# EAGLE design Gateway-Header (EAGLE 7.5.0)
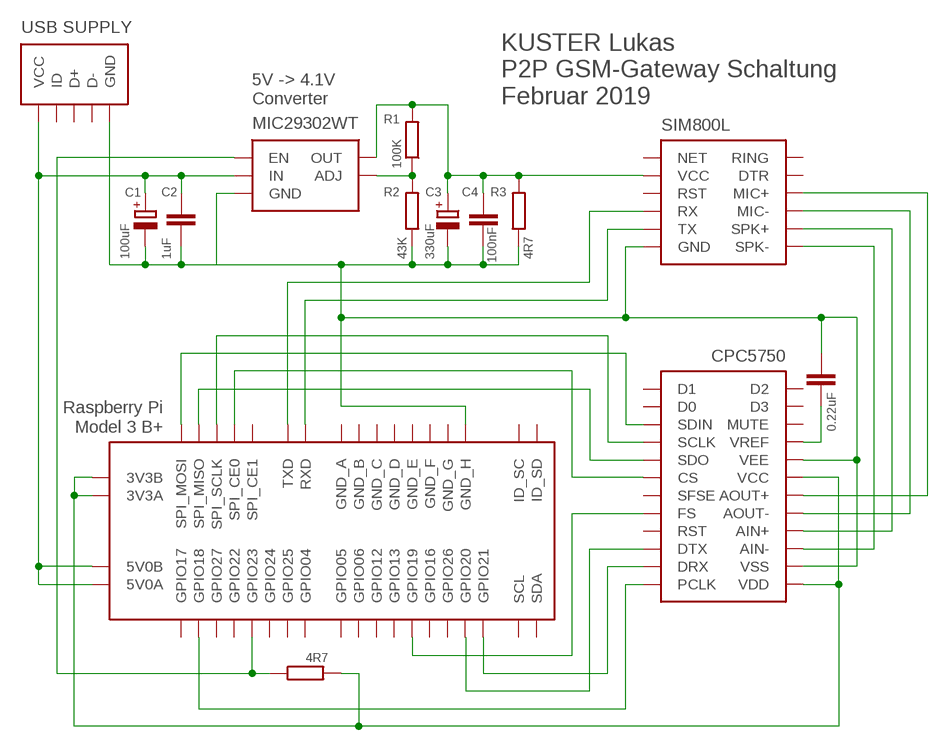
[diagram p0: schematic, sheet 1]

## Parts
C  0.22uF  C-EU025-025X050  [C025-025X050]
C1  100uF  CPOL-EUB45181B  [B45181B]
C2  1uF  C-EU025-025X050  [C025-025X050]
C3  330uF  CPOL-EUB45181B  [B45181B]
C4  100nF  C-EU025-025X050  [C025-025X050]
IC2  MIC29302WT  [TO254P483X1022X1511-5P]
R1  100K  R-EU_0204/7  [0204/7]
R2  43K  R-EU_0204/7  [0204/7]
R3  4R7  R-EU_0204/7  [0204/7]
R5  4R7  R-EU_0204/7  [0204/7]
U$4  CPC5750  [CPC5750]
U$5  SIM800LMODULE  [SIM800LMODULE]
U$6  ZX62D-B-5P8-JUNK  [ZX62D-B-5P8]
X1  RASPI_BOARD_B+#_H  [RASPI_BOARD_B+HAT]

## Nets
+3.3V: R5.2 U$4.V_CC(VCC) U$4.V_DD(VDD) X1.1(3V3A) X1.17(3V3B)
+4V: C3.+ C4.2 IC2.4(OUT) R1.2 R3.2 U$5.VCC
+5V: C1.+ C2.2 IC2.2(IN) U$6.P$1(VCC) X1.2(5V0A) X1.4(5V0B)
GND: C1.- C2.1 C3.- C4.1 C.2 IC2.3(GND) R2.1 R3.1 U$4.V_EE(VEE) U$4.V_SS(VSS) U$5.GND U$6.P$5(GND) X1.39(GND_H)
N$15: U$5.RX X1.8(TXD)
N$18: U$5.TX X1.10(RXD)
N$19: IC2.5(ADJ) R1.1 R2.2
N$20: U$4.A_IN-(AIN-) U$5.SPK-
N$21: U$4.A_IN+(AIN+) U$5.SPK+
N$22: U$4.A_OUT-(AOUT-) U$5.MIC-
N$23: U$4.A_OUT+(AOUT+) U$5.MIC+
N$24: C.1 U$4.V_REF(VREF)
N$25: U$4.CS X1.24(SPI_CE0)
N$26: U$4.SCLK X1.23(SPI_SCLK)
N$27: U$4.SDIN X1.19(SPI_MOSI)
N$28: U$4.SDO X1.21(SPI_MISO)
N$29: U$4.PCLK X1.12(GPIO18)
N$30: U$4.D_RX(DRX) X1.40(GPIO21)
N$31: U$4.D_TX(DTX) X1.38(GPIO20)
N$32: U$4.FS X1.35(GPIO19)
N$33: IC2.1(EN) R5.1 X1.16(GPIO23)
Unconnected: U$4.D0 U$4.D1 U$4.D2 U$4.D3 U$4.MUTE U$4.RST U$4.SFSEL(SFSE) U$5.DTR U$5.NET U$5.RING U$5.RST U$6.P$2(D-) U$6.P$3(D+) U$6.P$4(ID) X1.3(SDA) X1.5(SCL) X1.7(GPIO04) X1.11(GPIO17) X1.13(GPIO27) X1.15(GPIO22) X1.18(GPIO24) X1.22(GPIO25) X1.26(SPI_CE1) X1.27(ID_SD) X1.28(ID_SC) X1.29(GPIO05) X1.31(GPIO06) X1.32(GPIO12) X1.33(GPIO13) X1.36(GPIO16) X1.37(GPIO26)

## Notes on the sheet
- 5V -> 4.1V
  Converter
- KUSTER Lukas
  P2P GSM-Gateway Schaltung
  Februar 2019

## Power pins joined to a net without a drawn wire
GND_A: X1.6(GND_A)
GND_B: X1.9(GND_B)
GND_C: X1.14(GND_C)
GND_D: X1.20(GND_D)
GND_E: X1.25(GND_E)
GND_F: X1.30(GND_F)
GND_G: X1.34(GND_G)

## Library data of the parts
C C2 C4 = rcl:C-EU: CAPACITOR, European symbol
C1 C3 = rcl:CPOL-EU: POLARIZED CAPACITOR, European symbol
IC2 = MIC29302WT:MIC29302WT: MIC29302WT, Low Dropout Voltage Regulator, Adjustable 3A, 1.25 26 V +/-1%, 5-Pin TO-220 Source: Datasheet <http://ww1.microchip.com/downloads/en/devicedoc/20005685a.pdf>; DESCRIPTION: MIC29302WT, Low Dropout Voltage Regulator, Adjustable 3A, 1.25 26 V +/-1%, 5-Pin TO-220; HEIGHT: 4.826mm; MANUFACTURER_NAME: Micrel; MANUFACTURER_PART_NUMBER: MIC29302WT; MOUSER_PART_NUMBER: 998-MIC29302WT; MOUSER_PRICE-STOCK: https://www.mouser.com/Search/Refine.aspx?Keyword=998-MIC29302WT; RS_PART_NUMBER: 0254579P; RS_PRICE-STOCK: http://uk.rs-online.com/web/p/products/0254579P
R1-R3 R5 = rcl:R-EU_: RESISTOR, European symbol
U$4 = DA-CPC5750U-1:CPC5750
U$5 = SIM800LMODULE:SIM800LMODULE: SIM800L Module
U$6 = j_usb_hirose_zx62d-b-5p8:ZX62D-B-5P8-JUNK: Hirose MicroUSB A/B Connector
X1 = raspberrypi_bastelstube_v13:RASPI_BOARD_B+#: Raspberry Pi GPIO connector with markings for the outer dimensions of the Raspberry Pi board model B+ with different sets of drill holes or mounting pads All pins connected

## Board
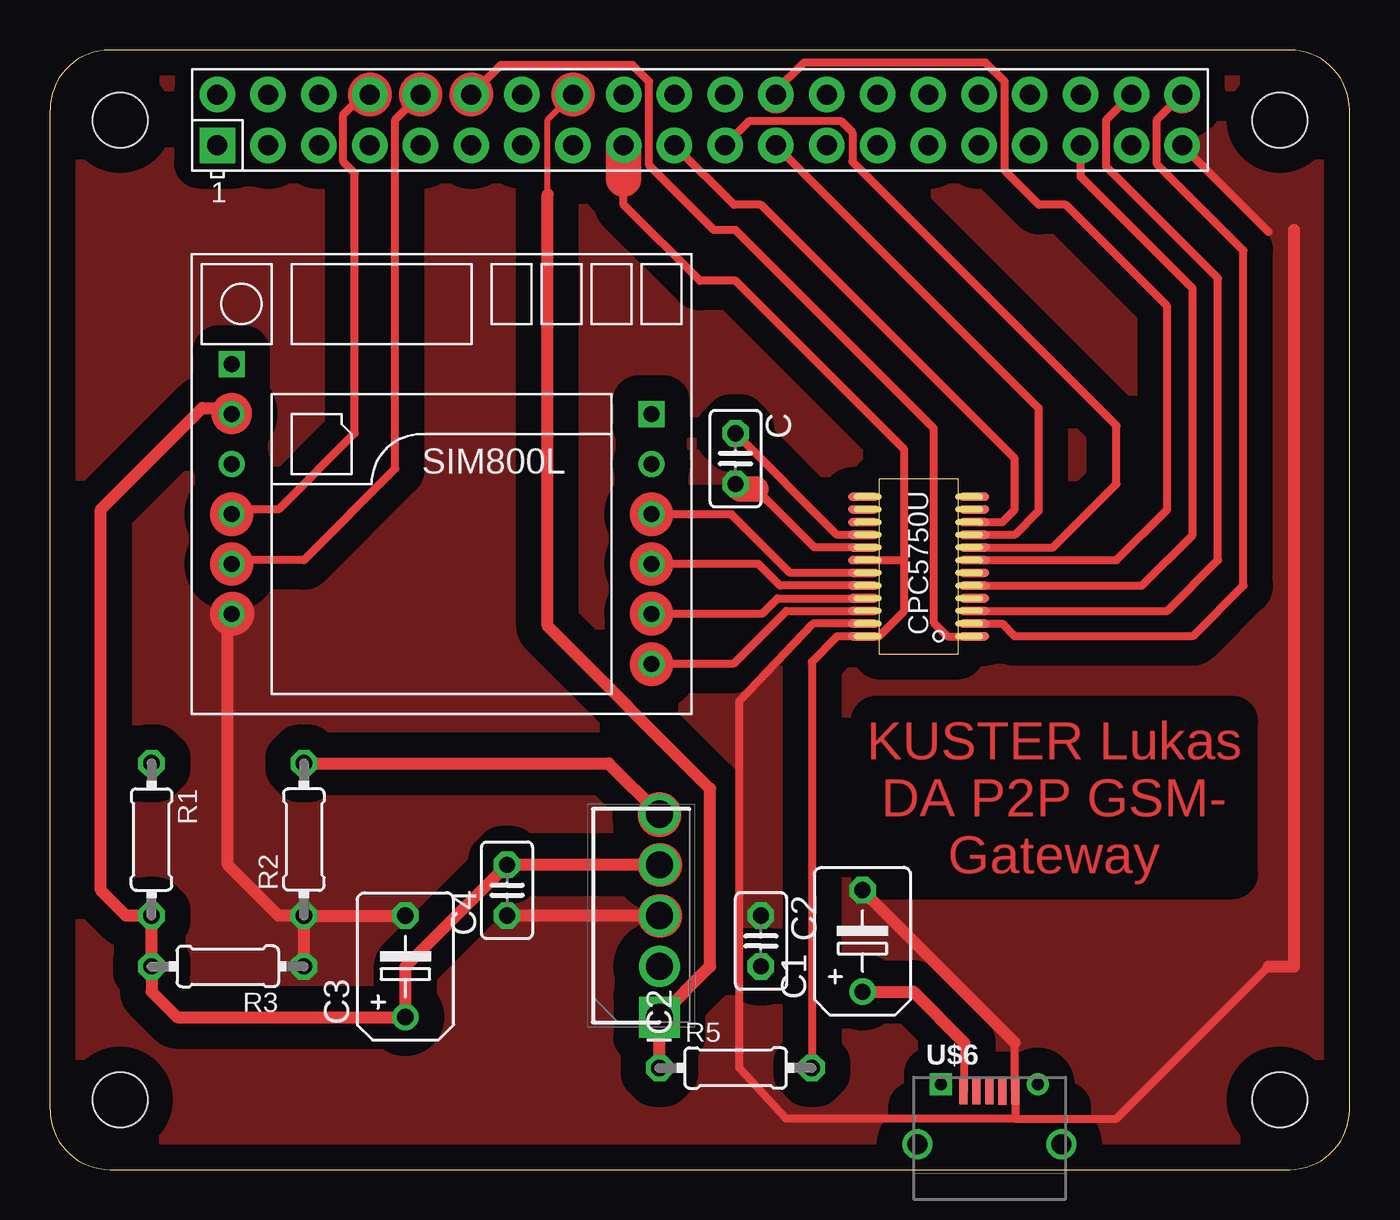
[diagram p1: board, top side]
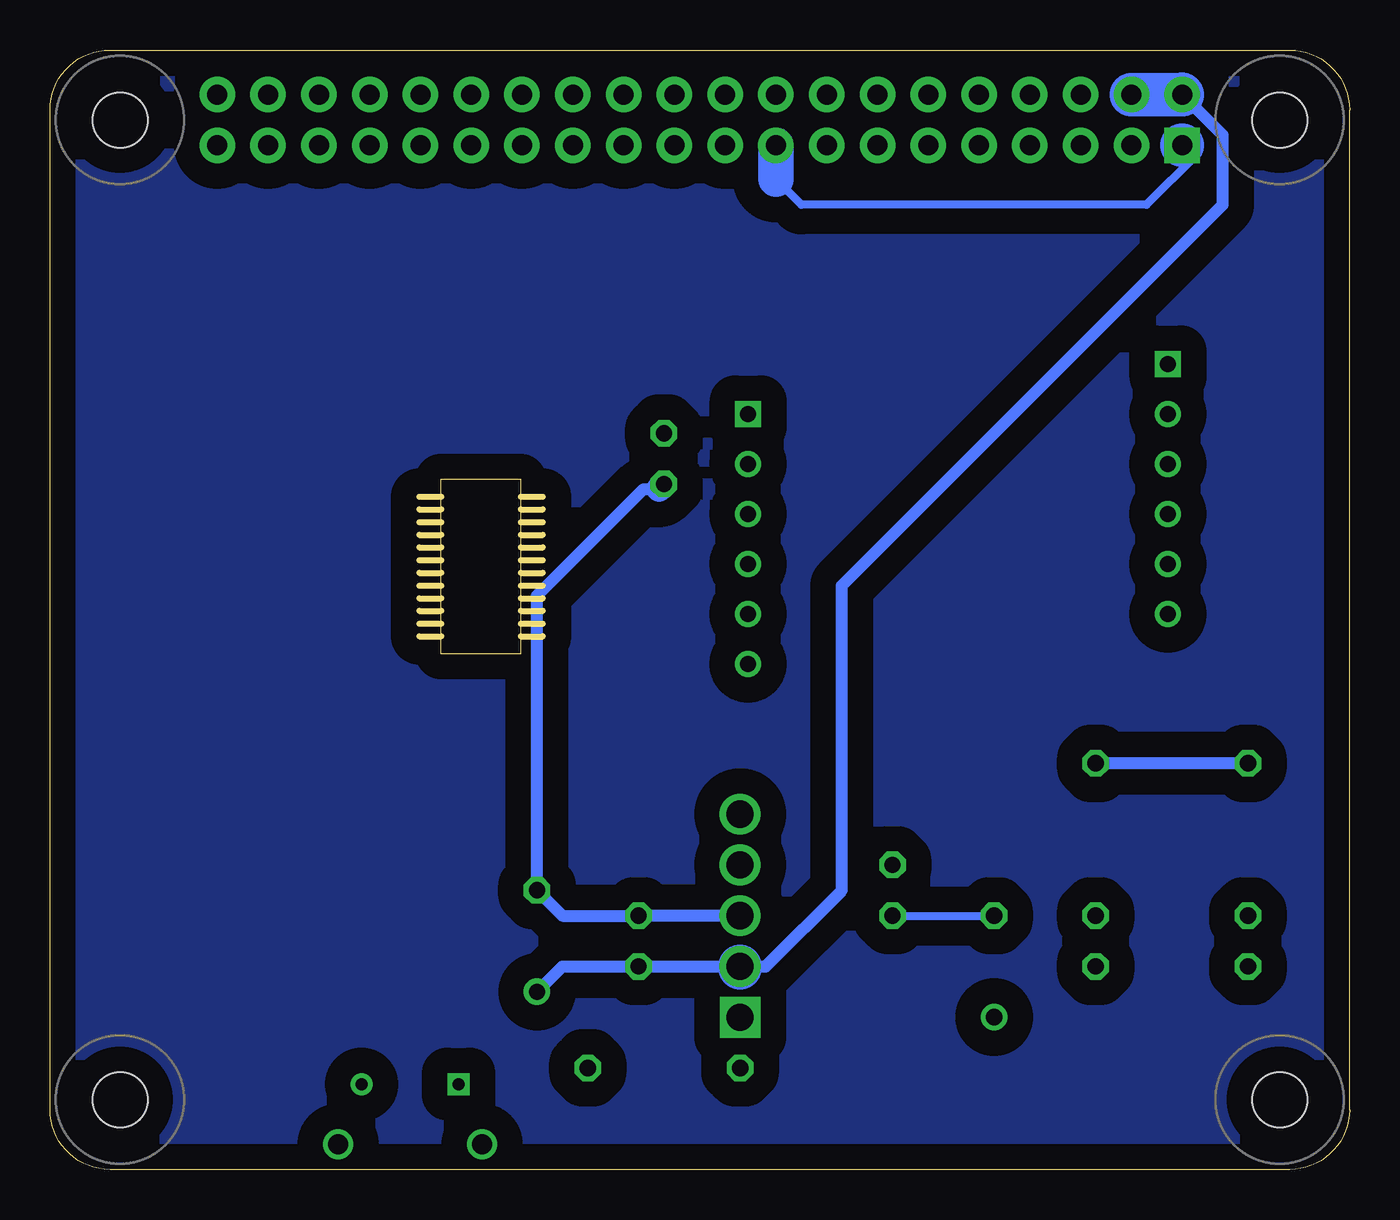
[diagram p2: board, bottom side, seen from below]

Size 65 x 56 mm. Coordinates in mm from the lower left corner, seen from the top.
Copper layers (1*16): Top 0.035mm / dielectric 1.5mm / Bottom 0.035mm
Design rules "default": minimum track width 10mil, minimum drill 24mil, track to track 8mil, track to pad 8mil, pad to pad 8mil, via to via 8mil, smd to smd 8mil, copper to edge 40mil, drill to drill 8mil, minimum pad ring 10mil, minimum via ring 8mil, stop-mask expansion 4mil, vias tented up to drill 0mil, thermal gap 10mil

### Footprints (pad centres in the part's own frame; a part is rotated, then mirrored left to right if it is on the bottom)
C025-025X050 = drill 0.813 octagon: 1 -1.27,0; 2 1.27,0
B45181B = drill 0.813: + -2.54,0 | drill 0.813 octagon: - 2.54,0
TO254P483X1022X1511-5P = drill 1.36 pad 2.04 square: 1 0,0 | drill 1.36 pad 2.04: 2 2.54,0; 3 5.08,0; 4 7.62,0; 5 10.16,0
0204/7 = drill 0.813 octagon: 1 -3.81,0; 2 3.81,0
CPC5750 = smd 0.406 x 1.549: A_IN+ 1.905,6.299; A_IN- 1.27,6.299; A_OUT+ 3.175,6.299; A_OUT- 2.54,6.299; CS 3.81,0.775; D0 6.35,0.775; D1 6.985,0.775; D2 6.985,6.299; D3 6.35,6.299; D_RX 0.635,0.775; D_TX 1.27,0.775; FS 2.54,0.775; MUTE 5.715,6.299; PCLK 0,0.775; RST 1.905,0.775; SCLK 5.08,0.775; SDIN 5.715,0.775; SDO 4.445,0.775; SFSEL 3.175,0.775; V_CC 3.81,6.299; V_DD 0,6.299; V_EE 4.445,6.299; V_REF 5.08,6.299; V_SS 0.635,6.299
SIM800LMODULE = drill 0.8: DTR 10.5,1; GND -10.5,-6.5; MIC+ 10.5,-1.5; MIC- 10.5,-4; RST -10.5,1; RX -10.5,-1.5; SPK+ 10.5,-6.5; SPK- 10.5,-9; TX -10.5,-4; VCC -10.5,3.5 | drill 0.8 square: NET -10.5,6; RING 10.5,3.5
ZX62D-B-5P8 = smd 0.4 x 1.35: P$1 -1.3,2.675; P$2 -0.65,2.675; P$3 0,2.675; P$4 0.65,2.675; P$5 1.3,2.675 | drill 0.6 pad 1 square: SH1 -2.425,3 | drill 0.6 pad 1: SH2 2.425,3 | drill 1 pad 1.4: SH3 -3.6,0; SH4 3.6,0
RASPI_BOARD_B+HAT = drill 1 pad 1.778 square: 1 8.37,51.23 | drill 1 pad 1.778: 2 8.37,53.77; 3 10.91,51.23; 4 10.91,53.77; 5 13.45,51.23; 6 13.45,53.77; 7 15.99,51.23; 8 15.99,53.77; 9 18.53,51.23; 10 18.53,53.77; 11 21.07,51.23; 12 21.07,53.77; 13 23.61,51.23; 14 23.61,53.77; 15 26.15,51.23; 16 26.15,53.77; 17 28.69,51.23; 18 28.69,53.77; 19 31.23,51.23; 20 31.23,53.77; 21 33.77,51.23; 22 33.77,53.77; 23 36.31,51.23; 24 36.31,53.77; 25 38.85,51.23; 26 38.85,53.77; 27 41.39,51.23; 28 41.39,53.77; 29 43.93,51.23; 30 43.93,53.77; 31 46.47,51.23; 32 46.47,53.77; 33 49.01,51.23; 34 49.01,53.77; 35 51.55,51.23; 36 51.55,53.77; 37 54.09,51.23; 38 54.09,53.77; 39 56.63,51.23; 40 56.63,53.77 | hole 2.75: 3.5,3.5; 3.5,52.5; 61.5,3.5; 61.5,52.5

### Placement (x,y rotation side)
C  34.29,35.56 270 top
C1  40.64,11.43 90 top
C2  35.56,11.43 270 top
C3  17.78,10.16 90 top
C4  22.86,13.97 90 top
IC2  30.48,7.62 90 top
R1  5.08,16.51 270 top
R2  12.7,16.51 90 top
R3  8.89,10.16 180 top
R5  34.29,5.08 0 top
U$4  46.99,26.67 90 top
U$5  19.58,34.29 0 top
U$6  46.99,1.27 0 top
X1  0,0 0 top

### Tracks (layer width: path | path; a pad name or v marks a point on that pad's centre or on a via)
+3.3V
  Top 0.406: R5.2 38.1,25.4 39.37,26.67 U$4.V_DD 41.47,26.67 42.74,27.94 42.74,30.48 | U$4.V_CC 42.74,30.48 | 42.74,30.48 42.74,36.01 34.29,44.45 32.5,44.45 28.69,48.26 X1.17
  Top 1.778: X1.17 28.69,49.53
  Bottom 0.406: 28.69,49.53 27.42,48.26 10.16,48.26 7.62,50.8 7.94,50.8 X1.1
  Bottom 1.778: 28.69,49.53 X1.17
  Bottom 2.184: X1.1 8.38,51.24
+4V
  Top 0.61: 30.54,15.24 C4.2 17.78,10.16 C3.+ 6.35,7.62 5.08,8.89 R3.2 R1.2 3.81,12.7 2.54,13.97 2.54,33.02 7.62,38.1 8.77,38.1 U$5.VCC
  Top 2.032: U$5.VCC 9.08,37.84 9.08,37.85
  Top 2.184: IC2.4 30.54,15.24
+5V
  Top 0.406: 45.72,6.35 45.72,3.98 U$6.P$1
  Top 0.61: C1.+ 43.18,8.89 45.72,6.35
  Bottom 0.61: C1.+ 39.37,10.16 C2.2 IC2.2 29.21,10.16 25.4,13.97 25.4,29.21 6.35,48.26 6.35,51.75 X1.2
  Bottom 2.184: 8.38,53.78 X1.2 X1.4 | IC2.2 30.48,10.1
GND  (via drill 0.6)
  Top 0.406: U$6.P$5 48.26,3.94 | U$4.V_SS 38.16,27.3 34.48,23.43 34.48,5.08 36.83,2.54 48.26,2.54 | U$6.P$5 48.26,3.98 48.26,6.35 | U$6.P$5 48.29,2.57 48.26,2.54 | 48.26,2.54 53.34,2.54 60.96,10.16 | 8.89,27.6 U$5.GND | U$4.V_EE 38.23,31.11 35.31,34.04 | 56.64,51.24 56.64,51.22 60.96,46.9
  Top 0.61: R2.1 C3.- | R2.1 11.43,12.7 8.89,15.24 8.89,27.6 | R3.1 R2.1 | v30.54,12.7 C4.1 | 48.26,6.35 C1.- | 60.96,10.16 62.23,10.16 62.23,46.99
  Top 1.27: 35.31,34.04 34.54,34.04 C.2
  Top 1.778: X1.39 56.64,51.24
  Top 2.184: U$5.GND 9.12,27.79 9.14,27.81 | IC2.3 v30.54,12.7
  Bottom 0.406: C4.1 C3.-
  Bottom 0.61: 34.54,34.04 35.31,34.04 40.64,28.7 C1.- 39.37,12.7 C2.1 v30.54,12.7
  Bottom 1.27: C.2 34.54,34.04
  pour Top (isolate 1.27, no thermals): 0,0 0,55.88 64.77,55.88 64.77,0
N$1
  pour Bottom (isolate 1.27): 0,0 64.77,0 64.77,55.88 0,55.88
N$15
  Top 0.406: X1.8 15.56,53.34 15.24,53.34 14.67,52.77 14.67,50.42 15.24,49.85 15.24,36.83 11.43,33.02 9.31,33.02 U$5.RX
  Top 2.184: X1.8 16,53.77 16,53.78 | U$5.RX 9.08,32.77
N$18
  Top 0.406: X1.10 17.27,52.51 17.27,35.05 12.7,30.48 9.27,30.48 U$5.TX
  Top 2.184: X1.10 18.54,53.78 | U$5.TX | U$5.TX
N$19
  Top 0.61: R2.2 27.94,20.32 IC2.5
  Top 2.184: IC2.5 30.48,17.72
  Bottom 0.61: R1.1 R2.2
N$20
  Top 0.406: U$4.A_IN- 36.83,27.94 34.18,25.29 U$5.SPK-
  Top 2.184: U$5.SPK- 30.1,25.27
N$21
  Top 0.406: U$4.A_IN+ 36.39,28.57 35.6,27.79 U$5.SPK+
  Top 2.184: U$5.SPK+ 30.1,27.81
N$22
  Top 0.406: U$4.A_OUT- 36.51,29.21 35.43,30.29 U$5.MIC-
  Top 2.184: U$5.MIC- 30.1,30.29
N$23
  Top 0.406: U$4.A_OUT+ 37.02,29.84 34.1,32.77 30.11,32.77 U$5.MIC+
  Top 2.184: U$5.MIC+ 30.1,32.77
N$24
  Top 0.406: U$4.V_REF 39.37,31.75 C.1
  Top 1.27: C.1 34.29,36.77
N$25
  Top 0.406: U$4.CS 53.34,30.48 55.88,33.02 55.88,43.18 50.8,48.26 49.47,48.26 47.75,49.97 47.75,54.42 46.8,55.37 37.72,55.37 36.32,53.98 36.32,53.72
  Top 1.778: X1.24 36.31,53.73 36.32,53.72
N$26
  Top 0.406: U$4.SCLK 48.26,31.75 49.44,32.93 49.44,38.1 36.32,51.22 36.32,51.24
  Top 1.778: X1.23 36.32,51.24
N$27
  Top 0.406: U$4.SDIN 47.62,32.38 48.26,33.02 48.26,35.56 35.56,48.26 34.2,48.26 31.24,51.22 31.24,51.24
  Top 1.778: X1.19 31.24,51.24
N$28
  Top 0.406: U$4.SDO 50.16,31.11 53.34,34.29 53.34,37.21 40.13,50.42 40.13,51.88 39.56,52.45 34.99,52.45 X1.21
  Top 1.778: X1.21 33.78,51.24
N$29
  Top 0.406: U$4.PCLK 44.9,26.67 44.2,27.37 44.2,37.08 34.29,46.99 33.21,46.99 29.97,50.23 29.97,54.42 29.15,55.24 22.55,55.24 X1.12
  Top 2.184: X1.12 21.08,53.78
N$30
  Top 0.406: U$4.D_RX 47.62,27.3 48.26,26.67 57.15,26.67 59.69,29.21 59.69,45.97 55.37,50.29 55.37,52.51 X1.40
  Top 1.778: X1.40 56.63,53.73 56.64,53.72
N$31
  Top 0.406: U$4.D_TX 55.88,27.94 58.42,30.48 58.42,44.58 52.83,50.16 52.83,52.51 X1.38
  Top 1.778: X1.38 54.1,53.78
N$32
  Top 0.406: U$4.FS 54.61,29.21 57.15,31.75 57.15,44.07 51.56,49.66 51.56,51.22 X1.35
  Top 1.778: 51.56,51.22 51.56,51.24
N$33
  Top 0.305: 24.89,48.77 24.89,52.51 X1.16
  Top 0.61: 24.89,48.77 24.89,27.18 33.02,19.05 33.02,10.16 IC2.1 R5.1
  Top 2.184: X1.16 26.16,53.78

### Text on the board
Top: KUSTER Lukas / DA P2P GSM- / Gateway